# Altium schematic sheet GMSL_DESERIALIZER.SchDoc
size C; SheetNumber: 3; SheetTotal: 19
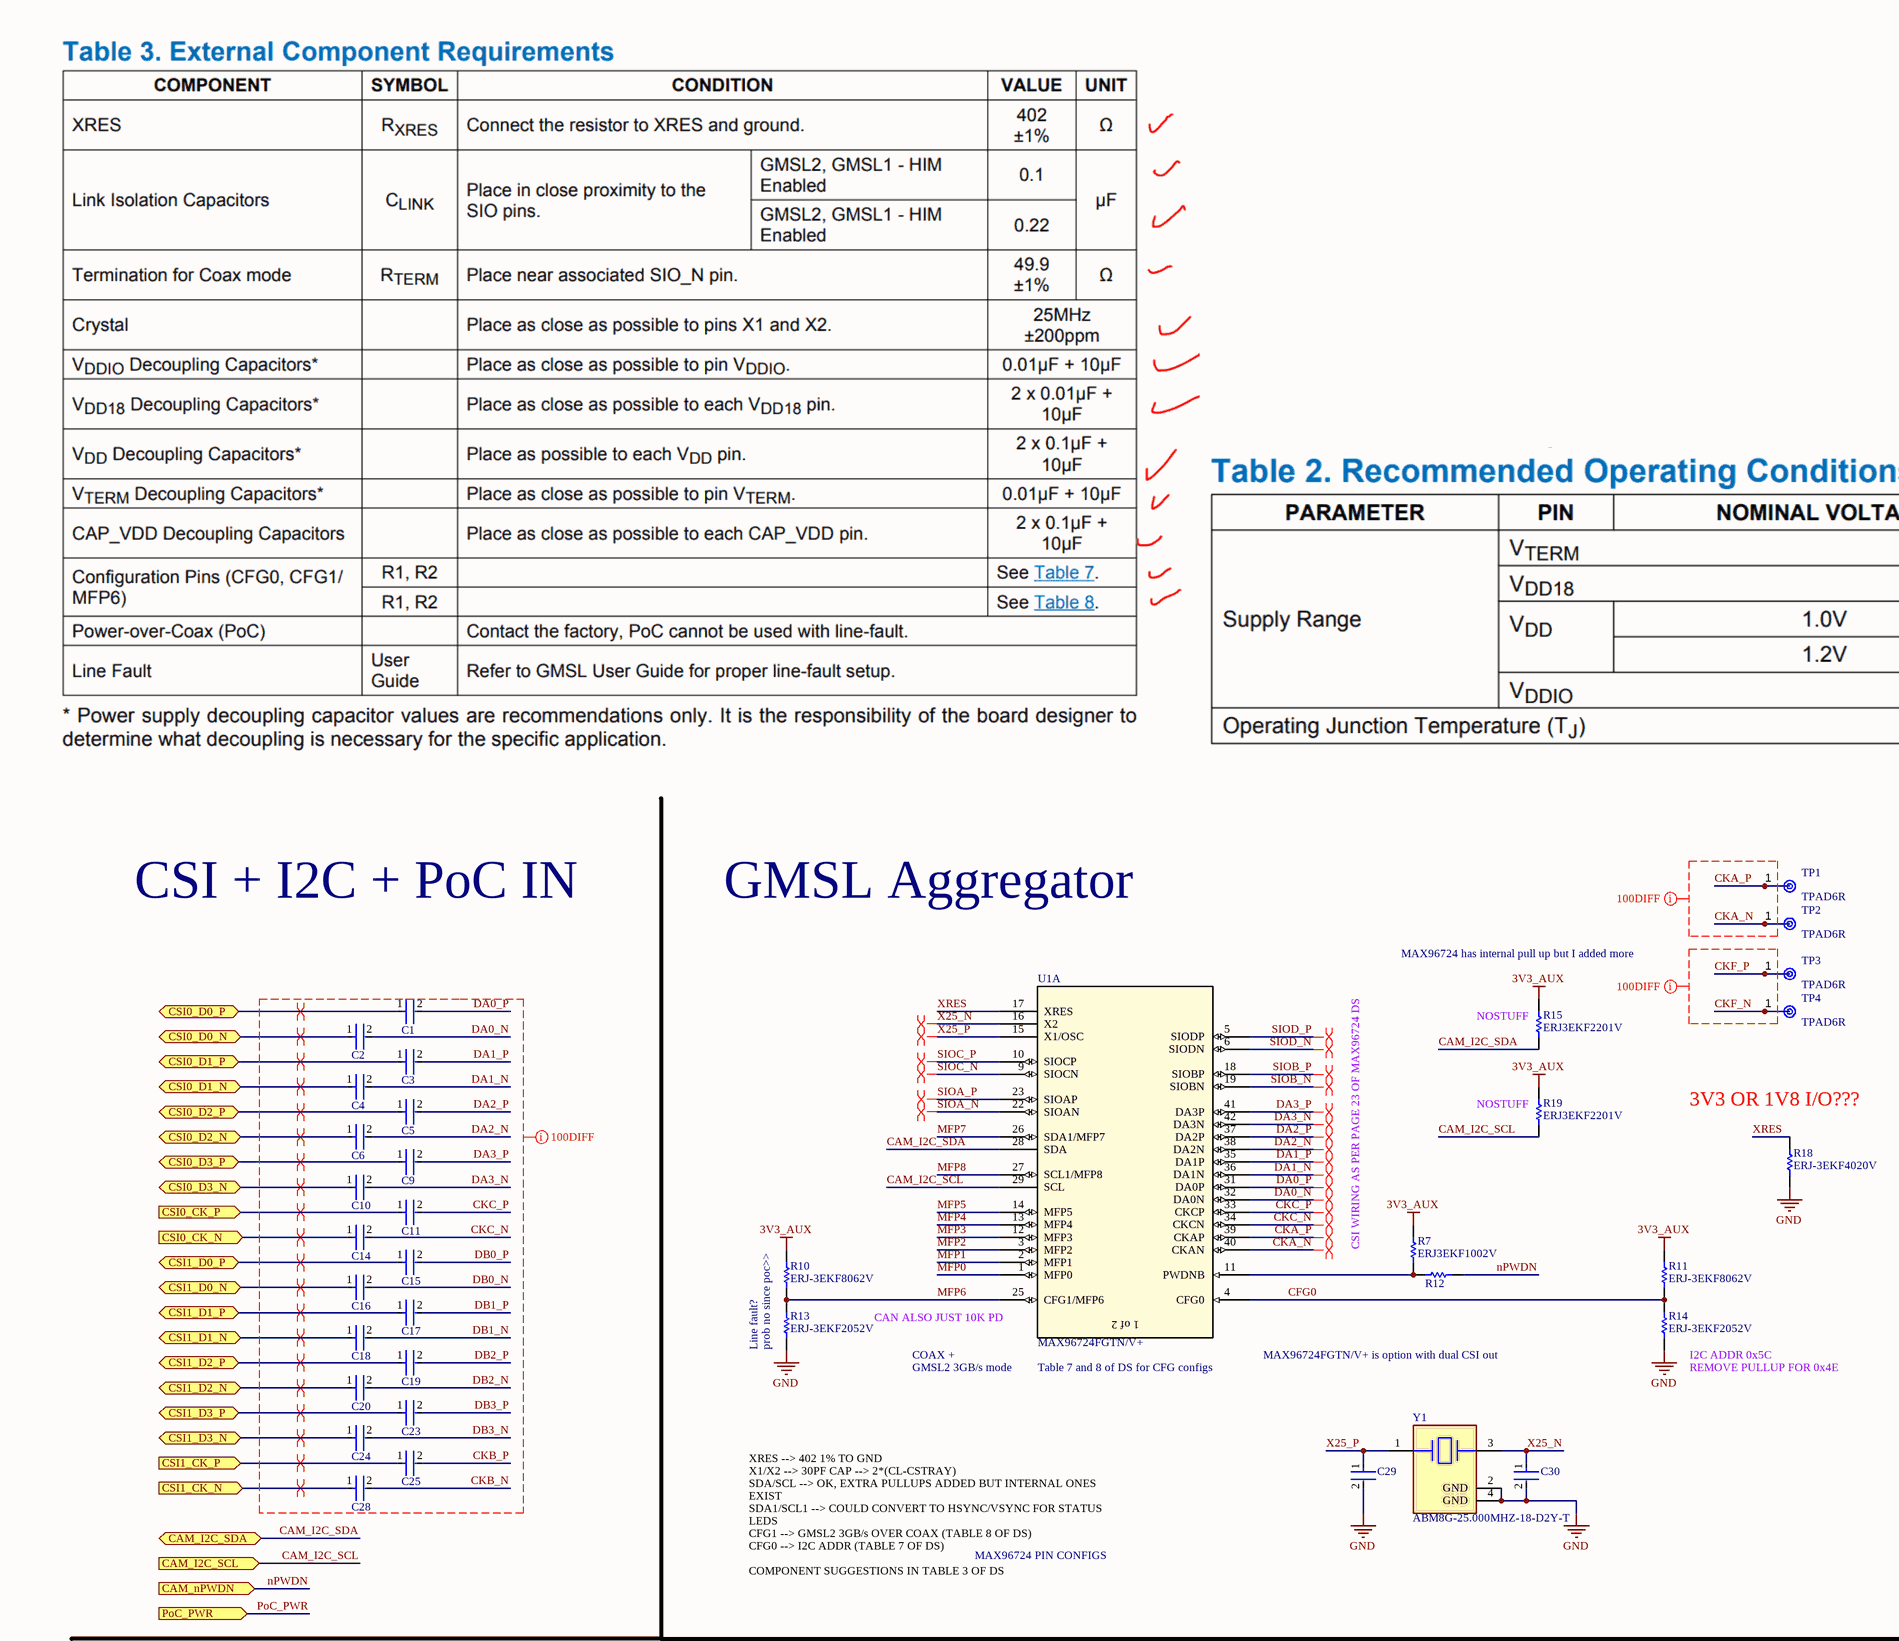
[diagram p0: GMSL_DESERIALIZER.SchDoc, top left]
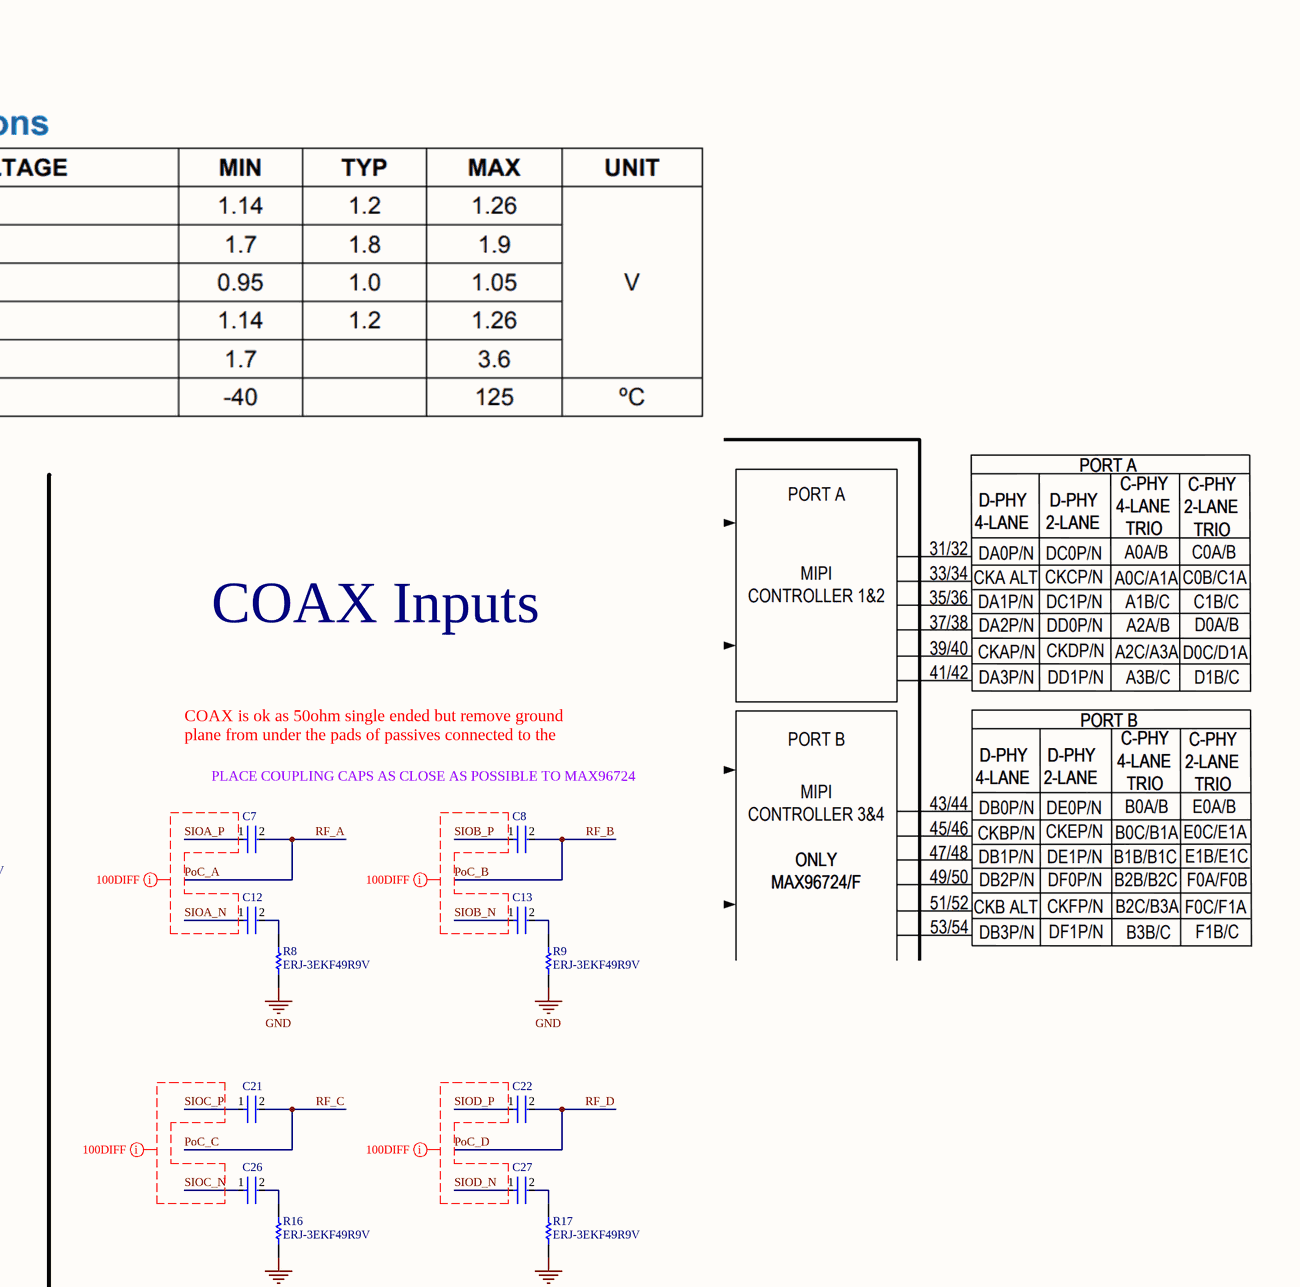
[diagram p1: GMSL_DESERIALIZER.SchDoc, top right]
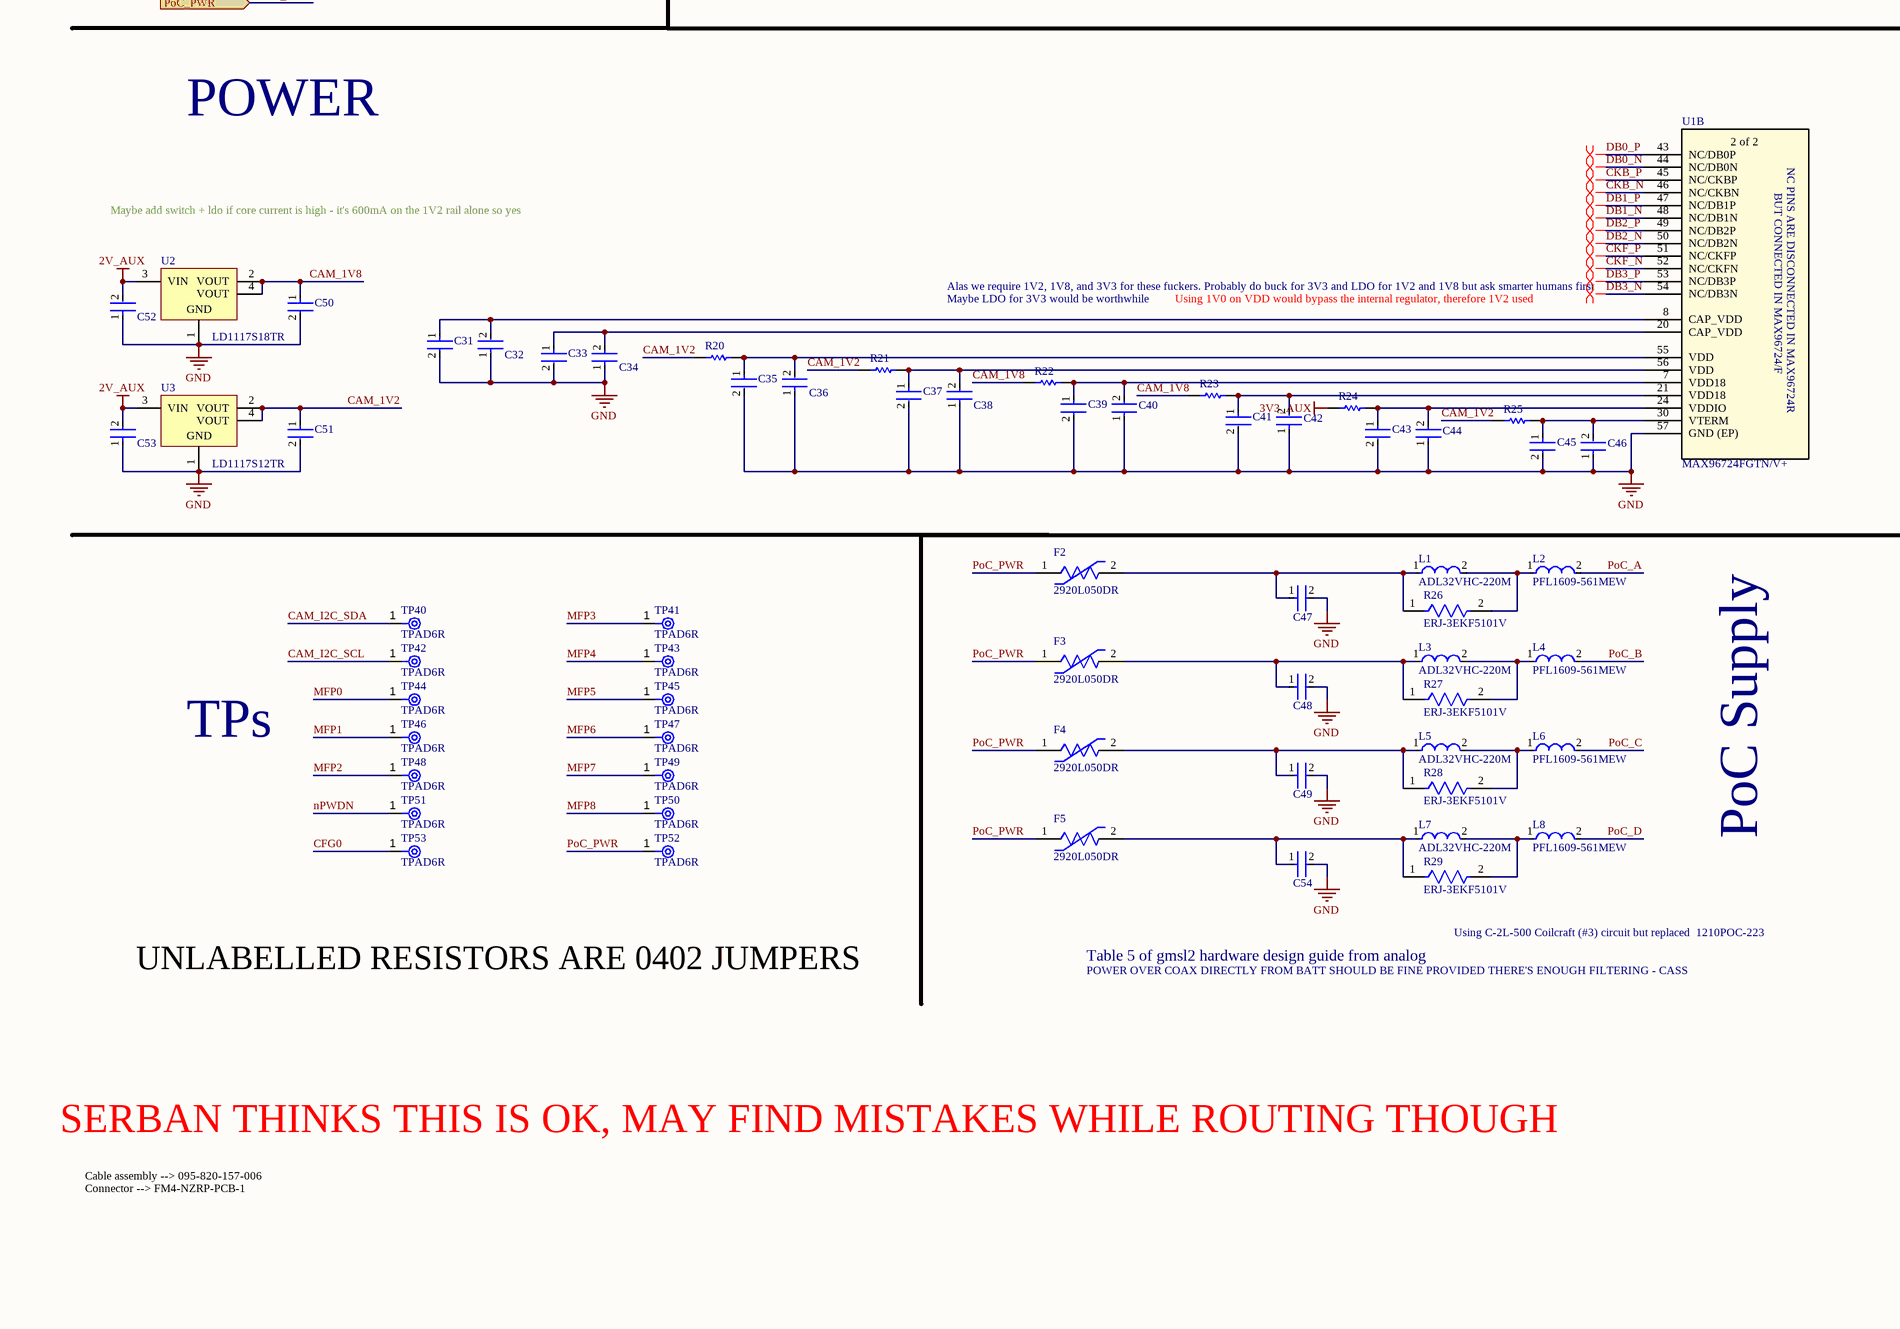
[diagram p2: GMSL_DESERIALIZER.SchDoc, bottom left]
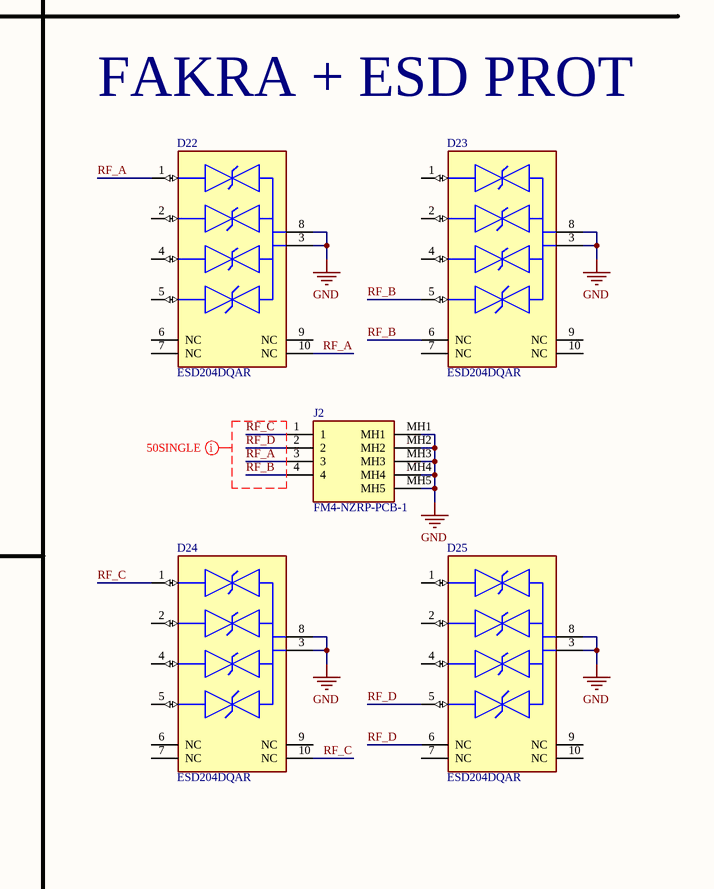
[diagram p3: GMSL_DESERIALIZER.SchDoc, bottom right]

## Parts
C1  C1005X7R1H104K050BB  [FP-C1005-050-0_05-IPC_C]  (value not drawn)
C2  C1005X7R1H104K050BB  [FP-C1005-050-0_05-IPC_C]  (value not drawn)
C3  C1005X7R1H104K050BB  [FP-C1005-050-0_05-IPC_C]  (value not drawn)
C4  C1005X7R1H104K050BB  [FP-C1005-050-0_05-IPC_C]  (value not drawn)
C5  C1005X7R1H104K050BB  [FP-C1005-050-0_05-IPC_C]  (value not drawn)
C6  C1005X7R1H104K050BB  [FP-C1005-050-0_05-IPC_C]  (value not drawn)
C7  C1005X7R1A224K050BB  [FP-C1005-050-0_05-IPC_C]  (value not drawn)
C8  C1005X7R1A224K050BB  [FP-C1005-050-0_05-IPC_C]  (value not drawn)
C9  C1005X7R1H104K050BB  [FP-C1005-050-0_05-IPC_C]  (value not drawn)
C10  C1005X7R1H104K050BB  [FP-C1005-050-0_05-IPC_C]  (value not drawn)
C11  C1005X7R1H104K050BB  [FP-C1005-050-0_05-IPC_C]  (value not drawn)
C12  C1005X7R1A224K050BB  [FP-C1005-050-0_05-IPC_C]  (value not drawn)
C13  C1005X7R1A224K050BB  [FP-C1005-050-0_05-IPC_C]  (value not drawn)
C14  C1005X7R1H104K050BB  [FP-C1005-050-0_05-IPC_C]  (value not drawn)
C15  C1005X7R1H104K050BB  [FP-C1005-050-0_05-IPC_C]  (value not drawn)
C16  C1005X7R1H104K050BB  [FP-C1005-050-0_05-IPC_C]  (value not drawn)
C17  C1005X7R1H104K050BB  [FP-C1005-050-0_05-IPC_C]  (value not drawn)
C18  C1005X7R1H104K050BB  [FP-C1005-050-0_05-IPC_C]  (value not drawn)
C19  C1005X7R1H104K050BB  [FP-C1005-050-0_05-IPC_C]  (value not drawn)
C20  C1005X7R1H104K050BB  [FP-C1005-050-0_05-IPC_C]  (value not drawn)
C21  C1005X7R1A224K050BB  [FP-C1005-050-0_05-IPC_C]  (value not drawn)
C22  C1005X7R1A224K050BB  [FP-C1005-050-0_05-IPC_C]  (value not drawn)
C23  C1005X7R1H104K050BB  [FP-C1005-050-0_05-IPC_C]  (value not drawn)
C24  C1005X7R1H104K050BB  [FP-C1005-050-0_05-IPC_C]  (value not drawn)
C25  C1005X7R1H104K050BB  [FP-C1005-050-0_05-IPC_C]  (value not drawn)
C26  C1005X7R1A224K050BB  [FP-C1005-050-0_05-IPC_C]  (value not drawn)
C27  C1005X7R1A224K050BB  [FP-C1005-050-0_05-IPC_C]  (value not drawn)
C28  C1005X7R1H104K050BB  [FP-C1005-050-0_05-IPC_C]  (value not drawn)
C29  C0603C300J5GACTU  [FP-C0603C-CF-MFG]  (value not drawn)
C30  C0603C300J5GACTU  [FP-C0603C-CF-MFG]  (value not drawn)
C31  CL05A106MP5NUNC  [FP-CL05A106MP5NUNC-MFG]  (value not drawn)
C32  C1005X7R1H104K050BB  [FP-C1005-050-0_05-IPC_C]  (value not drawn)
C33  CL05A106MP5NUNC  [FP-CL05A106MP5NUNC-MFG]  (value not drawn)
C34  C1005X7R1H104K050BB  [FP-C1005-050-0_05-IPC_C]  (value not drawn)
C35  CL05A106MP5NUNC  [FP-CL05A106MP5NUNC-MFG]  (value not drawn)
C36  C1005X7R1H104K050BB  [FP-C1005-050-0_05-IPC_C]  (value not drawn)
C37  CL05A106MP5NUNC  [FP-CL05A106MP5NUNC-MFG]  (value not drawn)
C38  C1005X7R1H104K050BB  [FP-C1005-050-0_05-IPC_C]  (value not drawn)
C39  CL05A106MP5NUNC  [FP-CL05A106MP5NUNC-MFG]  (value not drawn)
C40  C0402C103M5RACTU  [FP-C0402-BB-MFG]  (value not drawn)
C41  CL05A106MP5NUNC  [FP-CL05A106MP5NUNC-MFG]  (value not drawn)
C42  C0402C103M5RACTU  [FP-C0402-BB-MFG]  (value not drawn)
C43  CL05A106MP5NUNC  [FP-CL05A106MP5NUNC-MFG]  (value not drawn)
C44  C0402C103M5RACTU  [FP-C0402-BB-MFG]  (value not drawn)
C45  CL05A106MP5NUNC  [FP-CL05A106MP5NUNC-MFG]  (value not drawn)
C46  C0402C103M5RACTU  [FP-C0402-BB-MFG]  (value not drawn)
C47  GRM21BR61E226ME44L  [FP-GRM21B-0_2-e0_2_0_7-IPC_B]  (value not drawn)
C48  GRM21BR61E226ME44L  [FP-GRM21B-0_2-e0_2_0_7-IPC_B]  (value not drawn)
C49  GRM21BR61E226ME44L  [FP-GRM21B-0_2-e0_2_0_7-IPC_B]  (value not drawn)
C50  GRM188R60J106ME47D  [FP-GRM188-0_1-e0_2_0_55-IPC_A]  (value not drawn)
C51  GRM188R60J106ME47D  [FP-GRM188-0_1-e0_2_0_55-IPC_A]  (value not drawn)
C52  C1005X7R1H104K050BB  [FP-C1005-050-0_05-IPC_C]  (value not drawn)
C53  C1005X7R1H104K050BB  [FP-C1005-050-0_05-IPC_C]  (value not drawn)
C54  GRM21BR61E226ME44L  [FP-GRM21B-0_2-e0_2_0_7-IPC_B]  (value not drawn)
D22  ESD204DQAR  [FP-DQA0010A-MFG]
D23  ESD204DQAR  [FP-DQA0010A-MFG]
D24  ESD204DQAR  [FP-DQA0010A-MFG]
D25  ESD204DQAR  [FP-DQA0010A-MFG]
F2  2920L050DR  [FP-2920L050DR-MFG]
F3  2920L050DR  [FP-2920L050DR-MFG]
F4  2920L050DR  [FP-2920L050DR-MFG]
F5  2920L050DR  [FP-2920L050DR-MFG]
J2  FM4-NZRP-PCB-1  [FM4-NZRP-PCB-1-Footprint-1]
L1  ADL32VHC-220M  [FP-1210POC-MFG]
L2  PFL1609-561MEW  [FP-PFL1609-MFG]
L3  ADL32VHC-220M  [FP-1210POC-MFG]
L4  PFL1609-561MEW  [FP-PFL1609-MFG]
L5  ADL32VHC-220M  [FP-1210POC-MFG]
L6  PFL1609-561MEW  [FP-PFL1609-MFG]
L7  ADL32VHC-220M  [FP-1210POC-MFG]
L8  PFL1609-561MEW  [FP-PFL1609-MFG]
R7  ERJ3EKF1002V  [RESC1609X55X30LL15T15]
R8  ERJ-3EKF49R9V  [RESC1608X55X30ML15T15]
R9  ERJ-3EKF49R9V  [RESC1608X55X30ML15T15]
R10  ERJ-3EKF8062V  [RESC1608X55X30LL15T15]
R11  ERJ-3EKF8062V  [RESC1608X55X30LL15T15]
R12  0402 JUMPER  [RESC1005X40X25ML05T05]  (value not drawn)
R13  ERJ-3EKF2052V  [RESC1608X55X30NL15T15]
R14  ERJ-3EKF2052V  [RESC1608X55X30NL15T15]
R15  ERJ3EKF2201V  [RESC1608X55X30LL15T15]
R16  ERJ-3EKF49R9V  [RESC1608X55X30ML15T15]
R17  ERJ-3EKF49R9V  [RESC1608X55X30ML15T15]
R18  ERJ-3EKF4020V  [RESC1608X55X30LL15T15]
R19  ERJ3EKF2201V  [RESC1608X55X30LL15T15]
R20  RC0402JR-070RL  [RESC1005X40X25NL05T10]  (value not drawn)
R21  RC0402JR-070RL  [RESC1005X40X25NL05T10]  (value not drawn)
R22  RC0402JR-070RL  [RESC1005X40X25NL05T10]  (value not drawn)
R23  RC0402JR-070RL  [RESC1005X40X25NL05T10]  (value not drawn)
R24  RC0402JR-070RL  [RESC1005X40X25NL05T10]  (value not drawn)
R25  RC0402JR-070RL  [RESC1005X40X25NL05T10]  (value not drawn)
R26  ERJ-3EKF5101V  [FP-ERJ3EK-MFG]
R27  ERJ-3EKF5101V  [FP-ERJ3EK-MFG]
R28  ERJ-3EKF5101V  [FP-ERJ3EK-MFG]
R29  ERJ-3EKF5101V  [FP-ERJ3EK-MFG]
TP1  TPAD6R  [New footprint 1]
TP2  TPAD6R  [New footprint 1]
TP3  TPAD6R  [New footprint 1]
TP4  TPAD6R  [New footprint 1]
TP40  TPAD6R  [New footprint 1]
TP41  TPAD6R  [New footprint 1]
TP42  TPAD6R  [New footprint 1]
TP43  TPAD6R  [New footprint 1]
TP44  TPAD6R  [New footprint 1]
TP45  TPAD6R  [New footprint 1]
TP46  TPAD6R  [New footprint 1]
TP47  TPAD6R  [New footprint 1]
TP48  TPAD6R  [New footprint 1]
TP49  TPAD6R  [New footprint 1]
TP50  TPAD6R  [New footprint 1]
TP51  TPAD6R  [New footprint 1]
TP52  TPAD6R  [New footprint 1]
TP53  TPAD6R  [New footprint 1]
U1  MAX96724FGTN/V+  [MAX96724FGTN_V+-Footprint-1]  (parts A,B of 2)
U2  LD1117S18TR  [SOT-223_M]
U3  LD1117S12TR  [SOT-223_M]
Y1  ABM8G-25.000MHZ-18-D2Y-T  [FP-ABM8G-MFG]

## Ports
CAM_I2C_SCL (in, see VISION_BETA_EBB[6B], JETSON[10C]), CAM_I2C_SDA (bidir, see VISION_BETA_EBB[6B], JETSON[10C]), CAM_nPWDN (in, see VISION_BETA_EBB[6B]), CSI0_CK_N (in, see VISION_BETA_EBB[6B]), CSI0_CK_P (in, see VISION_BETA_EBB[6B]), CSI0_D0_N (bidir, see VISION_BETA_EBB[6B], JETSON[9A]), CSI0_D0_P (bidir, see VISION_BETA_EBB[6B], JETSON[9A]), CSI0_D1_N (bidir, see VISION_BETA_EBB[6B], JETSON[9A]), CSI0_D1_P (bidir, see VISION_BETA_EBB[6B], JETSON[9B]), CSI0_D2_N (bidir, see VISION_BETA_EBB[6B]), CSI0_D2_P (bidir, see VISION_BETA_EBB[6B]), CSI0_D3_N (bidir, see VISION_BETA_EBB[6B]), CSI0_D3_P (bidir, see VISION_BETA_EBB[6B]), CSI1_CK_N (in, see VISION_BETA_EBB[6B]), CSI1_CK_P (in, see VISION_BETA_EBB[6B]), CSI1_D0_N (bidir, see VISION_BETA_EBB[6B]), CSI1_D0_P (bidir, see VISION_BETA_EBB[6B]), CSI1_D1_N (bidir, see VISION_BETA_EBB[6B]), CSI1_D1_P (bidir, see VISION_BETA_EBB[6B]), CSI1_D2_N (bidir, see VISION_BETA_EBB[6B]), CSI1_D2_P (bidir, see VISION_BETA_EBB[6B]), CSI1_D3_N (bidir, see VISION_BETA_EBB[6B]), CSI1_D3_P (bidir, see VISION_BETA_EBB[6B]), PoC_PWR (in, see VISION_BETA_EBB[6B], GMSL_SERIALIZER[1B])

## Nets
2V_AUX: C52.2 C53.2 U2.3(VIN) U3.3(VIN)
3V3_AUX: R7.2 R10.2 R11.2 R15.2 R19.2 R24.1
GND: C29.2 C30.2 C31.2 C32.1 C33.2 C34.1 C35.2 C36.1 C37.2 C38.1 C39.2 C40.1 C41.2 C42.1 C43.2 C44.1 C45.2 C46.1 C47.2 C48.2 C49.2 C50.2 C51.2 C52.1 C53.1 C54.2 D22.3(GND) D22.8(GND) D23.3(GND) D23.8(GND) D24.3(GND) D24.8(GND) D25.3(GND) D25.8(GND) J2.MH1 J2.MH2 J2.MH3 J2.MH4 J2.MH5 R8.1 R9.1 R13.1 R14.1 R16.1 R17.1 R18.1 U1.57(GND_(EP)) U2.1(GND) U3.1(GND) Y1.2(GND) Y1.4(GND)
CAM_1V2: C51.1 R20.1 R21.1 R25.1 U3.2(VOUT) U3.4(VOUT)
CAM_1V8: C50.1 R22.1 R23.1 U2.2(VOUT) U2.4(VOUT)
CAM_I2C_SCL: R19.1 TP42.1(TP) U1.29(SCL) ; port CAM_I2C_SCL
CAM_I2C_SDA: R15.1 TP40.1(TP) U1.28(SDA) ; port CAM_I2C_SDA
CFG0: R11.1 R14.2 TP53.1(TP) U1.4(CFG0)
CKA_N: TP2.1(TP) U1.40(CKAN)
CKA_P: TP1.1(TP) U1.39(CKAP)
CKB_N: C28.2 U1.46(NC/CKBN)
CKB_P: C25.2 U1.45(NC/CKBP)
CKC_N: C14.2 U1.34(CKCN)
CKC_P: C11.2 U1.33(CKCP)
CKF_N: TP4.1(TP) U1.52(NC/CKFN)
CKF_P: TP3.1(TP) U1.51(NC/CKFP)
CSI0_CK_N: C14.1 ; port CSI0_CK_N
CSI0_CK_P: C11.1 ; port CSI0_CK_P
CSI0_D0_N: C2.1 ; port CSI0_D0_N
CSI0_D0_P: C1.1 ; port CSI0_D0_P
CSI0_D1_N: C4.1 ; port CSI0_D1_N
CSI0_D1_P: C3.1 ; port CSI0_D1_P
CSI0_D2_N: C6.1 ; port CSI0_D2_N
CSI0_D2_P: C5.1 ; port CSI0_D2_P
CSI0_D3_N: C10.1 ; port CSI0_D3_N
CSI0_D3_P: C9.1 ; port CSI0_D3_P
CSI1_CK_N: C28.1 ; port CSI1_CK_N
CSI1_CK_P: C25.1 ; port CSI1_CK_P
CSI1_D0_N: C16.1 ; port CSI1_D0_N
CSI1_D0_P: C15.1 ; port CSI1_D0_P
CSI1_D1_N: C18.1 ; port CSI1_D1_N
CSI1_D1_P: C17.1 ; port CSI1_D1_P
CSI1_D2_N: C20.1 ; port CSI1_D2_N
CSI1_D2_P: C19.1 ; port CSI1_D2_P
CSI1_D3_N: C24.1 ; port CSI1_D3_N
CSI1_D3_P: C23.1 ; port CSI1_D3_P
DA0_N: C2.2 U1.32(DA0N)
DA0_P: C1.2 U1.31(DA0P)
DA1_N: C4.2 U1.36(DA1N)
DA1_P: C3.2 U1.35(DA1P)
DA2_N: C6.2 U1.38(DA2N)
DA2_P: C5.2 U1.37(DA2P)
DA3_N: C10.2 U1.42(DA3N)
DA3_P: C9.2 U1.41(DA3P)
DB0_N: C16.2 U1.44(NC/DB0N)
DB0_P: C15.2 U1.43(NC/DB0P)
DB1_N: C18.2 U1.48(NC/DB1N)
DB1_P: C17.2 U1.47(NC/DB1P)
DB2_N: C20.2 U1.50(NC/DB2N)
DB2_P: C19.2 U1.49(NC/DB2P)
DB3_N: C24.2 U1.54(NC/DB3N)
DB3_P: C23.2 U1.53(NC/DB3P)
MFP0: TP44.1(TP) U1.1(MFP0)
MFP1: TP46.1(TP) U1.2(MFP1)
MFP2: TP48.1(TP) U1.3(MFP2)
MFP3: TP41.1(TP) U1.12(MFP3)
MFP4: TP43.1(TP) U1.13(MFP4)
MFP5: TP45.1(TP) U1.14(MFP5)
MFP6: R10.1 R13.2 TP47.1(TP) U1.25(CFG1/MFP6)
MFP7: TP49.1(TP) U1.26(SDA1/MFP7)
MFP8: TP50.1(TP) U1.27(SCL1/MFP8)
nPWDN: R12.2 TP51.1(TP) ; port CAM_nPWDN
PoC_A: C7.2 D22.1(IO1) D22.10(NC) J2.3 L2.2  [also labelled RF_A]
PoC_B: C8.2 D23.5(IO4) D23.6(NC) J2.4 L4.2  [also labelled RF_B]
PoC_C: C21.2 D24.1(IO1) D24.10(NC) J2.1 L6.2  [also labelled RF_C]
PoC_D: C22.2 D25.5(IO4) D25.6(NC) J2.2 L8.2  [also labelled RF_D]
PoC_PWR: F2.1 F3.1 F4.1 F5.1 TP52.1(TP) ; port PoC_PWR
SIOA_N: C12.1 U1.22(SIOAN)
SIOA_P: C7.1 U1.23(SIOAP)
SIOB_N: C13.1 U1.19(SIOBN)
SIOB_P: C8.1 U1.18(SIOBP)
SIOC_N: C26.1 U1.9(SIOCN)
SIOC_P: C21.1 U1.10(SIOCP)
SIOD_N: C27.1 U1.6(SIODN)
SIOD_P: C22.1 U1.5(SIODP)
X25_N: C30.1 U1.16(X2) Y1.3
X25_P: C29.1 U1.15(X1/OSC) Y1.1
XRES: R18.2 U1.17(XRES)
NetC12_2: C12.2 R8.2
NetC13_2: C13.2 R9.2
NetC26_2: C26.2 R16.2
NetC27_2: C27.2 R17.2
NetC31_1: C31.1 C32.2 U1.8(CAP_VDD)
NetC33_1: C33.1 C34.2 U1.20(CAP_VDD)
NetC35_1: C35.1 C36.2 R20.2 U1.55(VDD)
NetC37_1: C37.1 C38.2 R21.2 U1.56(VDD)
NetC39_1: C39.1 C40.2 R22.2 U1.7(VDD18)
NetC41_1: C41.1 C42.2 R23.2 U1.21(VDD18)
NetC43_1: C43.1 C44.2 R24.2 U1.24(VDDIO)
NetC45_1: C45.1 C46.2 R25.2 U1.30(VTERM)
NetC47_1: C47.1 F2.2 L1.1 R26.1
NetC48_1: C48.1 F3.2 L3.1 R27.1
NetC49_1: C49.1 F4.2 L5.1 R28.1
NetC54_1: C54.1 F5.2 L7.1 R29.1
NetL1_2: L1.2 L2.1 R26.2
NetL3_2: L3.2 L4.1 R27.2
NetL5_2: L5.2 L6.1 R28.2
NetL7_2: L7.2 L8.1 R29.2
NetR7_1: R7.1 R12.1 U1.11(PWDNB)

Not connected (* = marked no-connect by the designer): D22 2(IO2) 4(IO3) 5(IO4) 6(NC) 7(NC) 9(NC); D23 1(IO1) 2(IO2) 4(IO3) 7(NC) 9(NC) 10(NC); D24 2(IO2) 4(IO3) 5(IO4) 6(NC) 7(NC) 9(NC); D25 1(IO1) 2(IO2) 4(IO3) 7(NC) 9(NC) 10(NC)

## Layout directives
differential pair; differential pair class 100DIFF: CKA_N, CKA_P, CKB_N, CKB_P, CKC_N, CKC_P, CKF_N, CKF_P, CSI0_CK_N, CSI0_CK_P, CSI0_D0_N, CSI0_D0_P, CSI0_D1_N, CSI0_D1_P, CSI0_D2_N, CSI0_D2_P, CSI0_D3_N, CSI0_D3_P, CSI1_CK_N, CSI1_CK_P, CSI1_D0_N, CSI1_D0_P, CSI1_D1_N, CSI1_D1_P, CSI1_D2_N, CSI1_D2_P, CSI1_D3_N, CSI1_D3_P, DA0_N, DA0_P, DA1_N, DA1_P, DA2_N, DA2_P, DA3_N, DA3_P, DB0_N, DB0_P, DB1_N, DB1_P, DB2_N, DB2_P, DB3_N, DB3_P, SIOA_N, SIOA_P, SIOB_N, SIOB_P, SIOC_N, SIOC_P, SIOD_N, SIOD_P
net class 50SINGLE: RF_A, RF_B, RF_C, RF_D
differential pair: X25_N, X25_P
net class 100DIFF: CKA_N, CKA_P, CKB_N, CKB_P, CKC_N, CKC_P, CKF_N, CKF_P, DA0_N, DA0_P, DA1_N, DA1_P, DA2_N, DA2_P, DA3_N, DA3_P, DB0_N, DB0_P, DB1_N, DB1_P, DB2_N, DB2_P, DB3_N, DB3_P, PoC_A, PoC_B, PoC_D, SIOA_N, SIOA_P, SIOB_N, SIOB_P, SIOC_N, SIOC_P, SIOD_N, SIOD_P

## Notes on the sheet
- CSI + I2C + PoC IN
- GMSL Aggregator
- MAX96724 has internal pull up but I added more
- COAX Inputs
- (near R15) NOSTUFF
- COAX is ok as 50ohm single ended but remove ground plane from under the pads of passives connected to the GMSL trace
- PLACE COUPLING CAPS AS CLOSE AS POSSIBLE TO MAX96724
- (near R19) NOSTUFF
- (near R18) 3V3 OR 1V8 I/O???
- CSI WIRING AS PER PAGE 23 OF MAX96724 DS
- Line fault?
- prob no since poc>>
- CAN ALSO JUST 10K PD
- GMSL2 3GB/s mode
- COAX +
- Table 7 and 8 of DS for CFG configs
- MAX96724FGTN/V+ is option with dual CSI out
- (near R14) I2C ADDR 0x5C
- (near R14) REMOVE PULLUP FOR 0x4E
- XRES --> 402 1% TO GND
  X1/X2 --> 30PF CAP --> 2*(CL-CSTRAY)
  SDA/SCL --> OK, EXTRA PULLUPS ADDED BUT INTERNAL ONES EXIST
  SDA1/SCL1 --> COULD CONVERT TO HSYNC/VSYNC FOR STATUS LEDS
  CFG1 --> GMSL2 3GB/s OVER COAX (TABLE 8 OF DS)
  CFG0 --> I2C ADDR (TABLE 7 OF DS)
  COMPONENT SUGGESTIONS IN TABLE 3 OF DS
  - DECOUPLING CAPS OK
- MAX96724 PIN CONFIGS
- FAKRA + ESD PROT
- POWER
- Maybe add switch + ldo if core current is high - it's 600mA on the 1V2 rail alone so yes
- (near U1) Alas we require 1V2, 1V8, and 3V3 for these fuckers. Probably do buck for 3V3 and LDO for 1V2 and 1V8 but ask smarter humans first
- Maybe LDO for 3V3 would be worthwhile
- Using 1V0 on VDD would bypass the internal regulator, therefore 1V2 used
- TPs
- PoC Supply
- Using C-2L-500 Coilcraft (#3) circuit but replaced  1210POC-223
- UNLABELLED RESISTORS ARE 0402 JUMPERS
- Table 5 of gmsl2 hardware design guide from analog
- POWER OVER COAX DIRECTLY FROM BATT SHOULD BE FINE PROVIDED THERE'S ENOUGH FILTERING - CASS
- SERBAN THINKS THIS IS OK, MAY FIND MISTAKES WHILE ROUTING THOUGH
- Cable assembly --> 095-820-157-006
  Connector --> FM4-NZRP-PCB-1
- (in symbol CMP-015-00011-2, part A) 1 of 2
- (in symbol CMP-015-00011-2, part B) 2 of 2; NC PINS ARE DISCONNECTED IN MAX96724R; BUT CONNECTED IN MAX96724/F

## Library data of the parts
C1-C6 C9-C11 C14-C20 C23-C25 C28 C32 C34 C36 C38 C52 C53 = CMP-2000-05393-2: Multilayer Ceramic Capacitors 100nF ±10% 50V X7R SMD 0402; Voltage: 50V; Dielectric Material: Ceramic; Min Operating Temperature: -55°C; Depth: 0.5mm; Radiation Hardening: No; RoHS Compliant: Yes; Voltage Rating (DC): 50V; Lead Free: Lead Free; Resistor Type: Ceramic; Height: 0.5mm; Dielectric: X7R; Thickness: 0.022inch; Case/Package: 0402; Case Code (Metric): 1005; Termination: SMD/SMT; Capacitance: 100nF; Packaging: Tape and Reel; Max Operating Temperature: 125°C; Mount: Surface Mount; Package Quantity: 1; Width: 0.02inch; Weight: 2.3E-05oz; Voltage Rating: 50V; Tolerance: 10%; Construction: Flat; Case Code (Imperial): 0402; Length: 1mm; REACH SVHC: No SVHC; Series: C
C7 C8 C12 C13 C21 C22 C26 C27 = CMP-08246-006072-1: Multilayer Ceramic Capacitors 220nF ±10% 10V X7R SMD 0402; Resistor Type: Ceramic; Dielectric: X7R; Voltage Rating (DC): 10V; Width: 0.02inch; Case Code (Metric): 1005; Mount: Surface Mount; Termination: SMD/SMT; Series: C; Tolerance: 10%; Depth: 0.5mm; Length: 1mm; Packaging: Tape and Reel; Radiation Hardening: No; Weight: 2.3E-05oz; Voltage Rating: 10V; Thickness: 0.022inch; Capacitance: 220nF; Case Code (Imperial): 0402; Lead Free: Lead Free; Case/Package: 0402; Package Quantity: 10000; Dielectric Material: Ceramic; RoHS Compliant: Yes; REACH SVHC: No SVHC; Min Operating Temperature: -55°C; Max Operating Temperature: 125°C; Height: 0.5mm; Construction: Flat
C29 C30 = CMP-1035-00914-3: CAP CER 30PF 50V 5% NP0 0603; Manufacturer: KEMET; Automotive Grade: Grade 1; Temperature Coefficient: 30ppm/°C; Material: Ceramic; Temperature Characteristic: C0G; Tolerance: 0.05; Manufacturer Part Number: C0603C300J5GACTU; ComponentLink2URL: https://api.kemet.com/component-edge/download/datasheet/C0603C100J5GACAUTO.pdf; Automotive: Yes; Device Class L2: Capacitors; Device Class L1: Passive Components; Device Class L3: Ceramic Capacitors; RoHS: TRUE; Octopart: https://octopart.com/c0603c300j5gactu-kemet-199455; Lead Free: Yes; Value: 30 pF; Temperature Range High: +125°C; Category: Cap; Temperature: -55°C to +125°C; Package: C0603C-CF; Capacitance: 30 pF; Digikey Description: CAP CER 30PF 50V 5% NP0 0603; Height: 0.87mm; ComponentLink2Description: Datasheet; Temperature Range Low: -55°C; Mouser Description: Multilayer Ceramic Capacitors MLCC - SMD/SMT 50volts 30pF C0G 5%; Voltage Rating: 50 V
C31 C33 C35 C37 C39 C41 C43 C45 = CMP-13271-000002-1: CAP CER 10UF 10V X5R 0402; Manufacturer: Samsung; Temperature Coefficient: 15%; Tolerance: 20%; Material: Ceramic; Octopart: https://octopart.com/cl05a106mp5nunc-samsung-22457395; Voltage Rating: 10V; RoHS: TRUE; Value: 10uF; Height: 0.7mm; Digikey Description: CAP CER 10UF 10V X5R 0402; Automotive: No; Package: CL05A106MP5NUNC; Device Class L1: Passive Components; Capacitance: 10uF; Temperature Range High: +85°C; ComponentLink2Description: Datasheet; Device Class L2: Capacitors; Temperature Characteristic: X5R; Manufacturer Part Number: CL05A106MP5NUNC; Temperature: -55°C to +85°C; ComponentLink2URL: http://www.samsungsem.com/kr/support/product-search/mlcc/__icsFiles/afieldfile/2019/05/10/19-CL05A106MP5NUNC.pdf; Device Class L3: Ceramic Capacitors; Category: Cap; Temperature Range Low: -55°C; Ipc Land Pattern Name: CAPC10050X50; Lead Free: Yes
C40 C42 C44 C46 = CMP-1034-01887-3: CAP CER 10000PF 50V 20% X7R 0402; Manufacturer: Kemet; Value: 10,000 pF; Tolerance: 0.2; Temperature Coefficient: 15%; Material: Ceramic; Temperature Range Low: -55°C; Digikey Description: CAP CER 10000PF 50V 20% X7R 0402; Temperature Characteristic: X7R; Device Class L2: Capacitors; RoHS: TRUE; Temperature Range High: +125°C; Mouser Description: Cap Ceramic 0.01uF 50V X7R 20% SMD 1.0 x 0.5 mm 125 C Paper T/R; Package: C0402-BB; ComponentLink2URL: https://content.kemet.com/datasheets/KEM_C1002_X7R_SMD.pdf; Device Class L1: Passive Components; ComponentLink2Description: Datasheet; Height: 0.55mm; Automotive: No; Temperature: -55°C to +125°C; Capacitance: 10,000 pF; Manufacturer Part Number: C0402C103M5RACTU; Device Class L3: Ceramic Capacitors; Voltage Rating: 50 V; Ipc Land Pattern Name: CAPC10050X50; Category: Cap; Octopart: https://octopart.com/c0402c103m5ractu-kemet-17125571; Lead Free: Yes
C47-C49 C54 = CMP-2007-03222-3: Chip Multilayer Ceramic Capacitors for General Purpose, 0805, 22uF, X5R, 15%, 20%, 25V; Case/Package: 0805; Depth: 1.25mm; Resistor Type: Ceramic; Voltage Rating: 25V; Lead Free: Lead Free; Voltage Rating (DC): 25V; Case Code (Metric): 2012; Thickness: 0.057inch; REACH SVHC: No SVHC; Material: Ceramic; Tolerance: 20%; Length: 2mm; Capacitance: 22uF; Case Code (Imperial): 0805; Max Operating Temperature: 85°C; Termination: SMD/SMT; Weight: 0.000335oz; Dielectric: X5R; Packaging: Tape and Reel; Voltage: 25V; Package Quantity: 3000; Height: 1.25mm; Mount: Surface Mount; Width: 1.25mm; Min Operating Temperature: -55°C
C50 C51 = CMP-2006-02792-2: Chip Multilayer Ceramic Capacitors for General Purpose, 0603, 10uF, X5R, 15%, 20%, 6.3V; Packaging: Tape and Reel; Voltage Rating (DC): 6.3V; Width: 0.031inch; Termination: SMD/SMT; Dielectric: X5R; Package Quantity: 4000; Voltage Rating: 6.3V; Capacitance: 10uF; Case/Package: 0603; Min Operating Temperature: -55°C; Voltage: 6.3V; Length: 1.6mm; Thickness: 0.035inch; Lead Free: Lead Free; Depth: 0.8mm; Case Code (Imperial): 0603; Max Operating Temperature: 85°C; Material: Ceramic; Height: 0.8mm; Tolerance: 20%; Mount: Surface Mount; REACH SVHC: No SVHC; Radiation Hardening: No; Case Code (Metric): 1608
D22-D25 = CMP-04989-000002-1: 4-CHANNEL LOW-CAPACITANCE SURGE; Manufacturer: Texas Instruments; Value: 0.55pF; Reverse Standoff Voltage: 3.6V; Standoff Height: 0mm; Breakdown Voltage: 5.5V; Peak Pulse Current: 5.5A; Clamping Voltage: 11.5V; Direction: Bidirectional; Peak Pulse Power: 50W; Number Of Channels: 4; Ambient Temperature Range High: +125°C; ComponentLink2Description: Datasheet; Height: 0.55mm; Lead Free: Yes; Device Class L3: unset; Temperature Range High: +125°C; Temperature Range Low: -40°C; Package: DQA0010A; Temperature: -40°C to +125°C; Capacitance: 0.55pF; RoHS: TRUE; Mouser Description: 4-Channel Low-Capacitance Surge and ESD Protection Diode 10-USON -40 to 125; Category: Diode; Device Class L1: Circuit Protection; Octopart: https://octopart.com/esd204dqar-texas+instruments-89917476; Device Class L2: TVS Diodes; Ambient Temperature Range Low: -40°C; Manufacturer Part Number: ESD204DQAR; ComponentLink2URL: http://www.ti.com/lit/ds/symlink/esd204.pdf; Automotive: No; Digikey Description: 4-CHANNEL LOW-CAPACITANCE SURGE
F2-F5 = CMP-08606-000071-1: PTC RESET FUSE 60V 500MA 2920; Resistance: 1.4R; Trip Current: 1A; Power Dissipation: 1.5W; Time to Trip: 4s; Approvals: cULus; Current Rating: 10A; Operating Supply Voltage: 60V; Termination: SMD/SMT; Width: 5.44mm; Case/Package: 2920; Series: 2920L; Case Code (Imperial): 2920; Height: 1.25mm; Hold Current: 500mA; Terminal Material: Copper; Min Operating Temperature: -40°C; Package Quantity: 1500; Max Voltage Rating (DC): 60V; RoHS Compliant: Yes; Case Code (Metric): 7351; Lead Free: Lead Free; Max Operating Temperature: 85°C; Voltage Rating (DC): 60V; Working Voltage: 60V; Length: 7.98mm; REACH SVHC: No SVHC; Max Current Rating: 10A; Voltage Rating: 60V; Packaging: Tape and Reel
J2 = CMP-002-00044-2: Connector RF Mini-FAKRA Plug 9GHz 50Ohm Solder Right Angle Through Hole; Component Type: Standard; Pins: 9; Source: fakra4ch.SchLib; Design Item ID: CMP-002-00085-1
L1 L3 L5 L7 = CMP-11268-000041-1: NOT COILCRAFT - ACTUAL P# --> ADL32VHC-220M / - Power Injection Chokes for PoC; Manufacturer Part Number: 1210POC-223MRC; Value: 22uH; Core Material: Ferrite; Saturation Current: 720mA; Series Resistance: 0.88Ω; Rms Current: 700mA; Automotive Grade: Grade 1; Self Resonant Frequency: 70MHz; Test Frequency: 100kHz; Tolerance: 20%; Ambient Temperature Range High: +125°C; Manufacturer: coilcraft; Octopart: https://octopart.com/1210poc-223mrc-coilcraft-103207315; Category: Ind; Device Class L2: Inductors; RoHS: TRUE; Device Class L3: Fixed Inductors; Package: 1210POC; Ambient Temperature Range Low: -40°C; ComponentLink2URL: https://drive.google.com/open?id=15FlOq8Y4YbRFohfA_cJ40jgnqs8va2Mh; Lead Free: Yes; Inductance: 22uH; Device Class L1: Passive Components; ComponentLink2Description: Datasheet; Automotive: Yes; Height: 3mm
L2 L4 L6 L8 = CMP-11268-000007-1: Fixed Inductors PFL1609 Low Profile 0.56 uH 20 % 1.4 A; Manufacturer: coilcraft; Rms Current: 1100mA; Self Resonant Frequency: 600MHz; Core Material: Composite; Tolerance: 20%; Value: 0.56uH; Automotive Grade: Grade 1; Saturation Current: 710mA; Test Frequency: 7.9MHz; Shielding: true; Series Resistance: 130mΩ; Lead Free: Yes; Device Class L1: Passive Components; Package: PFL1609; Octopart: https://octopart.com/pfl1609-561mew-coilcraft-20329171; ComponentLink2URL: https://www.coilcraft.com/pdfs/pfl1609.pdf; Manufacturer Part Number: PFL1609-561MEW; Ambient Temperature Range Low: -40°C; Composition: Wirewound; Inductance: 0.56uH; Device Class L2: Inductors; Category: Ind; Device Class L3: Fixed Inductors; Mouser Description: Fixed Inductors PFL1609 Low Profile 0.56 uH 20 % 1.4 A; Automotive: Yes; ComponentLink2Description: Datasheet; Ambient Temperature Range High: +105°C; Height: 0.95mm; RoHS: TRUE
R7 = CMP-1012-00623-3: Chip Resistor, 10 KOhm, +/- 1%, 0.1 W, -55 to 155 degC, 0603 (1608 Metric), RoHS, Tape and Reel; Manufacturer: Panasonic; Voltage Rating: 75V; Case\/Package: 0603; Power Rating: 100mW; Resistance: 10KOhm; Temperature Coefficient: 100ppm\/degreesC; Number of Pins: 2; Package Reference: 603; Depth: 0.8mm; Mount: SurfaceMount; Package Description: 2-Pin Surface Mount Device, Body 1.6 x 0.85 mm; Datasheet Version: 02/2017; Length: 1.6mm; Lead Free: LeadFree; Height: 0.45mm; Number of Terminations: 2; Max Power Dissipation: 100mW; Min Operating Temperature: -55degC; Datasheet URL: https://industrial.panasonic.com/cdbs/www-data/pdf/RDA0000/AOA0000C304.pdf; Termination: SMD/SMT; Case Code (Metric): 1608; Case Code (Imperial): 0603; Tolerance: 1%; Max Operating Temperature: 155degC; RoHSCompliant: true; Voltage Rating (DC): 75V; Radiation Hardening: No; Packaging: TapeandReel; Composition: ThickFilm; Mounting Technology: SurfaceMount; Manufacturer URL: http://www.panasonic.com/; Width: 0.031inch; REACH SVHC: NoSVHC; Contact Plating: Tin; Military Standard: Not; Package Quantity: 1
R8 R9 R16 R17 = CMP-2000-00538-1: Manufacturer: Panasonic; Part Number: ERJ-3EKF49R9V
R10 R11 = CMP-2000-00651-1: Manufacturer: Panasonic; Part Number: ERJ-3EKF8062V
R12 = CMP-009-00118-2: READ THE NAME; Pins: 2; Component Type: Standard; Design Item ID: CMP-009-00206-2; Source: 0402jump.SchLib
R13 R14 = CMP-2000-00323-1: Manufacturer: Panasonic; Part Number: ERJ-3EKF2052V
R15 R19 = CMP-2000-00336-1: Manufacturer: Panasonic; Part Number: ERJ3EKF2201V
R18 = CMP-2000-00484-1: Manufacturer: Panasonic; Part Number: ERJ-3EKF4020V
R20-R25 = CMP-1011-00001-2: Manufacturer: Yageo / Phycomp; Part Number: RC0402JR-070RL
R26-R29 = CMP-2000-00540-8: RES SMD 5.1K OHM 1% 1/10W 0603; Power Rating: 100mW; Temperature Coefficient: 100ppm/°C; Voltage Rating: 75V; Resistance: 5.1kR; Military Standard: Not; Case/Package: 0603; Packaging: Tape and Reel; Package Quantity: 1; Reach SVHC Compliant: Yes; Lead Free: Lead Free; Mount: Surface Mount; Size Code: 0603; Depth: 0.8mm; Resistance Tolerance: 1%; Number of Terminations: 2; Resistor Type: Thick Film; Width: 0.8mm; Construction: Rectangular; Series: ERJ; Radiation Hardening: No; Max Operating Temperature: 155°C; Features: Automotive AEC-Q200; Tolerance: 1%; Voltage Rating (DC): 75V; Length: 1.6mm; RoHS Compliant: Yes; Min Operating Temperature: -55°C; Case Code (Metric): 1608; Termination: SMD/SMT; Weight: 7.1E-05oz; Max Power Dissipation: 100mW; Contact Plating: Tin; Height: 0.022inch; Case Code (Imperial): 0603
TP1-TP4 TP40-TP53 = CMP-00025-2: Test Point .6mm
U1 = CMP-015-00011-2: Quad Tunneling GMSL2/1 to CSI-2 Deserializer
U2 = CMP-0244-00308-1: Fixed Low Drop Positive Voltage Regulator, 1.8V, 4-Pin SOT-223, Tape and Reel; ComponentLink1URL: http://www.st.com; PackageReference: SOT-223; PackageDescription: 4-Pin SOT-223 Package, 6.5 x 3.5 mm Body, 2.3 mm Pitch, 7 mm Lead Span; ComponentLink2URL: http://www.st.com/internet/com/TECHNICAL_RESOURCES/TECHNICAL_LITERATURE/DATASHEET/CD00000544.pdf; ComponentLink2Description: Datasheet; ComponentLink1Description: Manufacturer URL; DatasheetVersion: 1/11/2011; PackageVersion: 2010
U3 = CMP-0244-00318-1: Fixed Low Drop Positive Voltage Regulator, 1.2V, 4-Pin SOT-223, Tape and Reel; PackageDescription: 4-Pin SOT-223 Package, 6.5 x 3.5 mm Body, 2.3 mm Pitch, 7 mm Lead Span; PackageVersion: 2010; ComponentLink2Description: Datasheet; PackageReference: SOT-223; ComponentLink2URL: http://www.st.com/internet/com/TECHNICAL_RESOURCES/TECHNICAL_LITERATURE/DATASHEET/CD00000544.pdf; ComponentLink1Description: Manufacturer URL; DatasheetVersion: 1/11/2011; ComponentLink1URL: http://www.st.com
Y1 = CMP-2000-05733-3: Crystal 25MHz ±20ppm (Tol) ±30ppm (Stability) 18pF FUND 60Ω 4-Pin SMD T/R; Series Resistance: 60R; Length: 3.2mm; Depth: 2.5mm; Packaging: Tape and Reel; Min Operating Temperature: -40°C; Operating Frequency: 25 MHz; Lead Free: Lead Free; Number of Pins: 4; Frequency Tolerance: 20ppm; Radiation Hardening: No; Max Operating Temperature: 85°C; Termination: SMD/SMT; Frequency Stability: 30ppm; Frequency: 25MHz; Series: ABM8G; Mount: Surface Mount; Package Quantity: 1000; Height: 0.039inch; Width: 0.098inch; Case/Package: CSMD; ESR (Equivalent Series Resistance): 60R; Load Capacitance: 18pF; Tolerance: 20ppm